# Altium project MAGI'sPrototypeBoard.PrjPcb
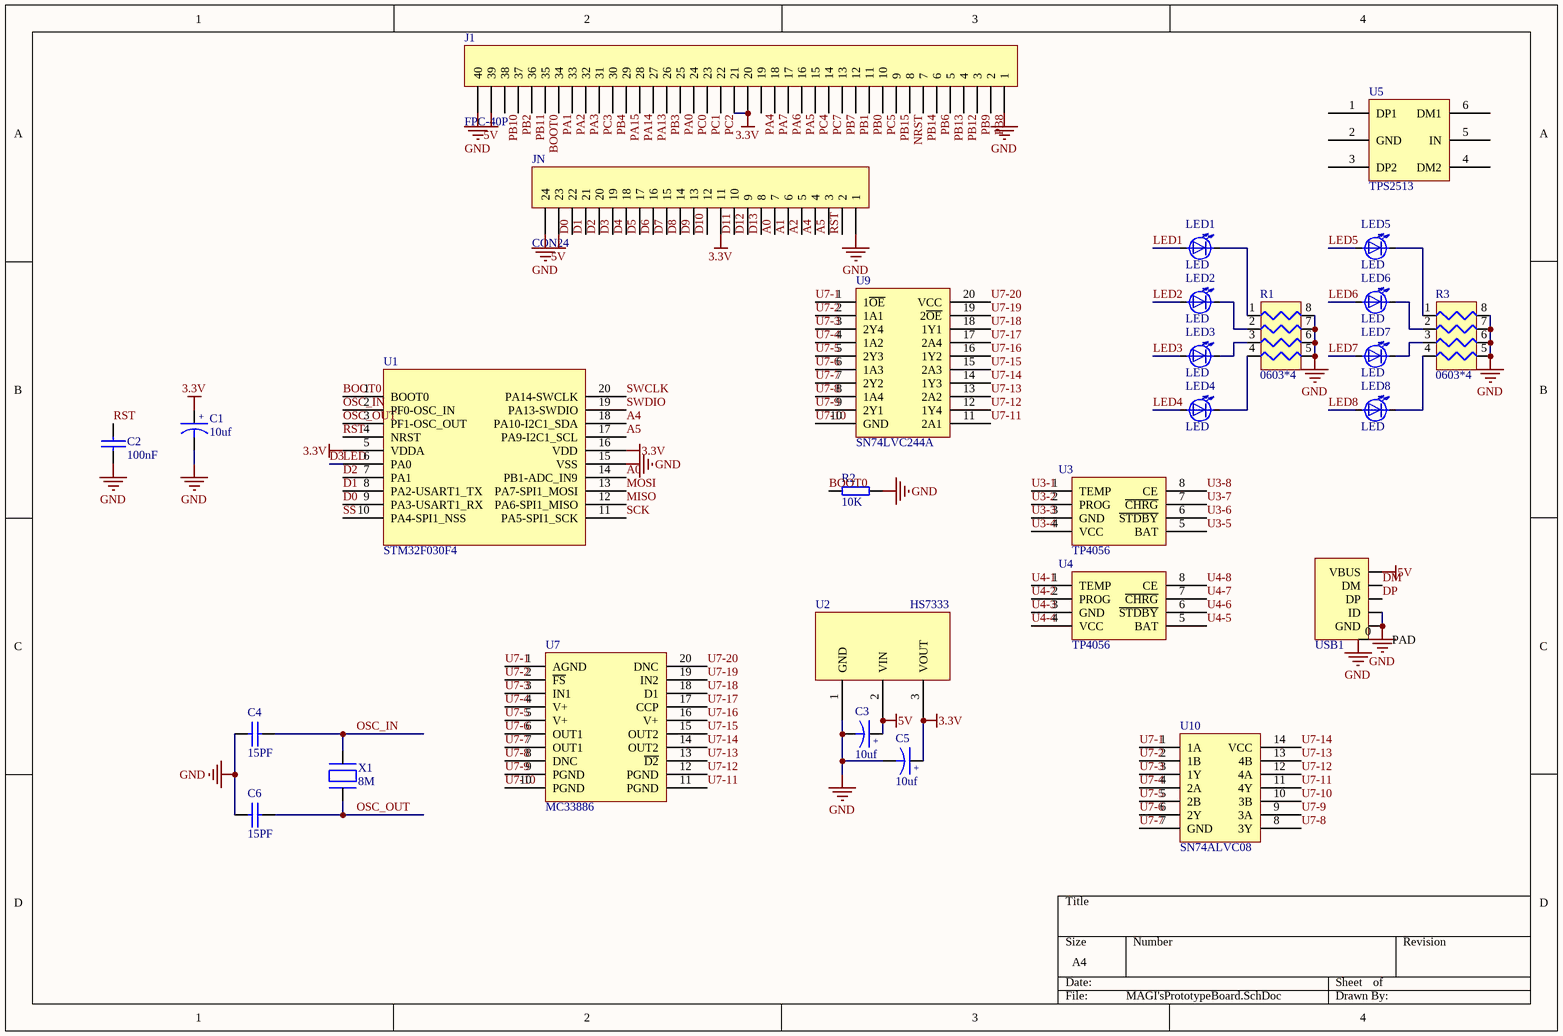
[diagram p0: MAGI'sPrototypeBoard.SchDoc]
1 sheet, 29 parts. Net scope: global (net labels, ports and power ports of the same name join across sheets).
Board file: MAGI'sPrototypeBoard.PcbDoc

## Sheet MAGI'sPrototypeBoard.SchDoc
size A4

### Parts
C1  10uf  [6-0805_n]
C2  100nF  [6-0805_n]
C3  10uf  [6-0805_n]
C4  15PF  [6-0805_n]
C5  10uf  [6-0805_n]
C6  15PF  [6-0805_n]
J1  FPC-40P  [FFC/SM0.5-2H40]
JN  CON24  [FFC/SM0.5-2H24]
LED1  LED  [6-0805_N]
LED2  LED  [6-0805_N]
LED3  LED  [6-0805_N]
LED4  LED  [6-0805_N]
LED5  LED  [6-0805_N]
LED6  LED  [6-0805_N]
LED7  LED  [6-0805_N]
LED8  LED  [6-0805_N]
R1  0603*4  [0603*4]
R2  10K  [6-0805_n]
R3  0603*4  [0603*4]
U1  STM32F030F4  [STM32F030]
U2  HS7333  [HS7333]
U3  TP4056  [TP4056]
U4  TP4056  [TP4056]
U5  TPS2513  [TPS2513]
U7  MC33886  [MC33886]
U9  SN74LVC244A  [TPS61030PWP]
U10  SN74ALVC08  [SN74ALVC08D]
USB1  USB_Micro  [MicroUSB-B]  (value not drawn)
X1  8M  [5032]

### Nets
3.3V: C1.1 C5.1 J1.20 J1.21 JN.11 U1.5(VDDA) U1.16(VDD) U2.3(VOUT)
5V: C3.1 J1.39 JN.23 U2.2(VIN) USB1.1(VBUS)
GND: C1.2 C2.1 C3.2 C4.1 C5.2 C6.1 J1.1 J1.40 JN.1 JN.24 R1.5 R1.6 R1.7 R1.8 R2.1 R3.5 R3.6 R3.7 R3.8 U1.15(VSS) U2.1(GND) USB1.0(PAD) USB1.4(ID) USB1.5(GND)
A0: JN.7 U1.14(PB1-ADC_IN9)
A1: JN.6
A2: JN.5
A4: JN.4 U1.18(PA10-I2C1_SDA)
A5: JN.3 U1.17(PA9-I2C1_SCL)
BOOT0: J1.35 R2.2 U1.1(BOOT0)
D0: JN.22 U1.9(PA3-USART1_RX)
D1: JN.21 U1.8(PA2-USART1_TX)
D2: JN.20 U1.7(PA1)
D3: JN.19 U1.6(PA0)  [also labelled LED]
D4: JN.18
D5: JN.17
D6: JN.16
D7: JN.15
D8: JN.14
D9: JN.13
D10: JN.12
D11: JN.10
D12: JN.9
D13: JN.8
DM: USB1.2(DM)
DP: USB1.3(DP)
LED1: LED1.1(A)
LED2: LED2.1(A)
LED3: LED3.1(A)
LED4: LED4.1(A)
LED5: LED5.1(A)
LED6: LED6.1(A)
LED7: LED7.1(A)
LED8: LED8.1(A)
MISO: U1.12(PA6-SPI1_MISO)
MOSI: U1.13(PA7-SPI1_MOSI)
NRST: J1.8
OSC_IN: C4.2 U1.2(PF0-OSC_IN) X1.1
OSC_OUT: C6.2 U1.3(PF1-OSC_OUT) X1.2
PA0: J1.25
PA1: J1.34
PA2: J1.33
PA3: J1.32
PA4: J1.19
PA5: J1.16
PA6: J1.17
PA7: J1.18
PA13: J1.27
PA14: J1.28
PA15: J1.29
PB0: J1.11
PB1: J1.12
PB2: J1.37
PB3: J1.26
PB4: J1.30
PB6: J1.6
PB7: J1.13
PB8: J1.2
PB9: J1.3
PB10: J1.38
PB11: J1.36
PB12: J1.4
PB13: J1.5
PB14: J1.7
PB15: J1.9
PC0: J1.24
PC1: J1.23
PC2: J1.22
PC3: J1.31
PC4: J1.15
PC5: J1.10
PC7: J1.14
RST: C2.2 JN.2 U1.4(NRST)
SCK: U1.11(PA5-SPI1_SCK)
SS: U1.10(PA4-SPI1_NSS)
SWCLK: U1.20(PA14-SWCLK)
SWDIO: U1.19(PA13-SWDIO)
U3-1: U3.1(TEMP)
U3-2: U3.2(PROG)
U3-3: U3.3(GND)
U3-4: U3.4(VCC)
U3-5: U3.5(BAT)
U3-6: U3.6(~{STDBY})
U3-7: U3.7(~{CHRG})
U3-8: U3.8(CE)
U4-1: U4.1(TEMP)
U4-2: U4.2(PROG)
U4-3: U4.3(GND)
U4-4: U4.4(VCC)
U4-5: U4.5(BAT)
U4-6: U4.6(~{STDBY})
U4-7: U4.7(~{CHRG})
U4-8: U4.8(CE)
U7-1: U7.1(AGND) U9.1(1~{OE}) U10.1(1A)
U7-2: U7.2(~{FS}) U9.2(1A1) U10.2(1B)
U7-3: U7.3(IN1) U9.3(2Y4) U10.3(1Y)
U7-4: U7.4(V+) U9.4(1A2) U10.4(2A)
U7-5: U7.5(V+) U9.5(2Y3) U10.5(2B)
U7-6: U7.6(OUT1) U9.6(1A3) U10.6(2Y)
U7-7: U7.7(OUT1) U9.7(2Y2) U10.7(GND)
U7-8: U7.8(DNC) U9.8(1A4) U10.8(3Y)
U7-9: U7.9(PGND) U9.9(2Y1) U10.9(3A)
U7-10: U7.10(PGND) U9.10(GND) U10.10(3B)
U7-11: U7.11(PGND) U9.11(2A1) U10.11(4Y)
U7-12: U7.12(PGND) U9.12(1Y4) U10.12(4A)
U7-13: U7.13(~{D2}) U9.13(2A2) U10.13(4B)
U7-14: U7.14(OUT2) U9.14(1Y3) U10.14(VCC)
U7-15: U7.15(OUT2) U9.15(2A3)
U7-16: U7.16(V+) U9.16(1Y2)
U7-17: U7.17(CCP) U9.17(2A4)
U7-18: U7.18(D1) U9.18(1Y1)
U7-19: U7.19(IN2) U9.19(2~{OE})
U7-20: U7.20(DNC) U9.20(VCC)
NetLED1_2: LED1.2(K) R1.1
NetLED2_2: LED2.2(K) R1.2
NetLED3_2: LED3.2(K) R1.3
NetLED4_2: LED4.2(K) R1.4
NetLED5_2: LED5.2(K) R3.1
NetLED6_2: LED6.2(K) R3.2
NetLED7_2: LED7.2(K) R3.3
NetLED8_2: LED8.2(K) R3.4

Not connected (* = marked no-connect by the designer): U5 1(DP1) 2(GND) 3(DP2) 4(DM2) 5(IN) 6(DM1)

### Notes on the sheet
- (in symbol CAPACITOR POL) +

### Library data of the parts
C1 C3 C5 = CAPACITOR POL: Capacitor
C2 C4 C6 = CAP
J1 = CON40: Connector
JN = CON24: Connector
LED1-LED8 = LED_3
R2 = RES
U9 = 74LVC244
USB1 = USB_Micro: USB
X1 = CRYSTAL